# EAGLE schematic RC522_schematic (EAGLE 7.1.0)
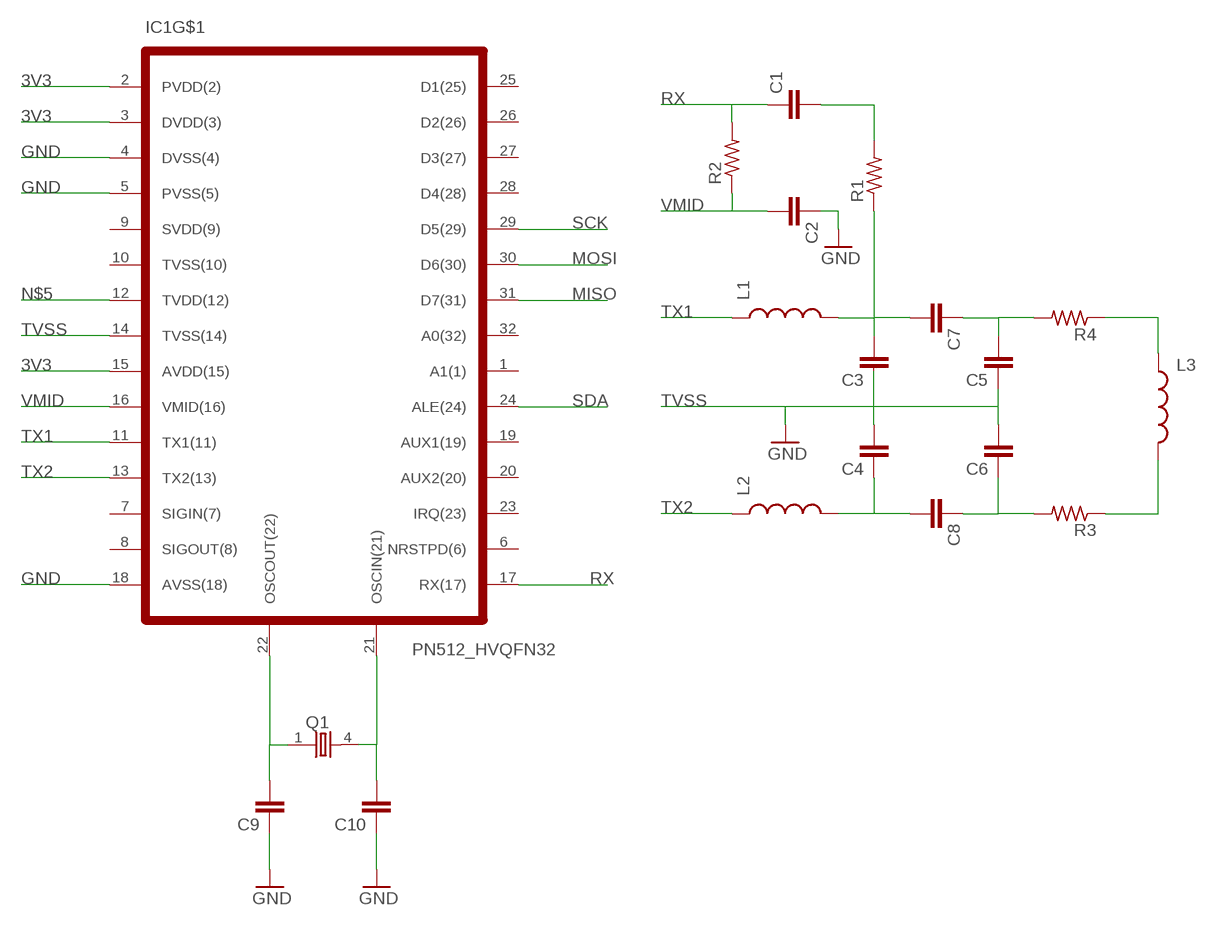
[diagram p0: schematic, sheet 1]

## Parts
C1  CAP0805  [0805]
C2  CAP0805  [0805]
C3  CAP0805  [0805]
C4  CAP0805  [0805]
C5  CAP0805  [0805]
C6  CAP0805  [0805]
C7  CAP0805  [0805]
C8  CAP0805  [0805]
C9  CAP0805  [0805]
C10  CAP0805  [0805]
IC1  PN512_HVQFN32  [HVQFN32]
L1  INDUCTOR0805  [0805]
L2  INDUCTOR0805  [0805]
L3  INDUCTOR0805  [0805]
Q1  86SMX  [86SMX]
R1  R-US_M0805  [M0805]
R2  R-US_M0805  [M0805]
R3  R-US_M0805  [M0805]
R4  R-US_M0805  [M0805]

## Nets
3V3: IC1.2(PVDD(2)) IC1.3(DVDD(3)) IC1.15(AVDD(15))
GND: C2.1 C9.1 C10.1 IC1.4(DVSS(4)) IC1.5(PVSS(5)) IC1.18(AVSS(18))
MISO: IC1.31(D7(31))
MOSI: IC1.30(D6(30))
N$2: C1.2 R1.2
N$5: IC1.12(TVDD(12))
N$6: C3.2 C7.2 L1.2 R1.1
N$7: C9.2 IC1.22(OSCOUT(22)) Q1.1
N$8: C4.1 C8.2 L2.2
N$9: C5.2 C7.1 R4.2
N$10: C6.1 C8.1 R3.2
N$11: C10.2 IC1.21(OSCIN(21)) Q1.4
N$12: L3.1 R4.1
N$13: L3.2 R3.1
RX: C1.1 IC1.17(RX(17)) R2.2
SCK: IC1.29(D5(29))
SDA: IC1.24(ALE(24))
TVSS: C3.1 C4.2 C5.1 C6.2 IC1.14(TVSS(14)) ; supply symbol labelled GND
TX1: IC1.11(TX1(11)) L1.1
TX2: IC1.13(TX2(13)) L2.1
VMID: C2.2 IC1.16(VMID(16)) R2.1
Unconnected: IC1.1(A1(1)) IC1.6(NRSTPD(6)) IC1.7(SIGIN(7)) IC1.8(SIGOUT(8)) IC1.10(TVSS(10)) IC1.19(AUX1(19)) IC1.20(AUX2(20)) IC1.23(IRQ(23)) IC1.25(D1(25)) IC1.26(D2(26)) IC1.27(D3(27)) IC1.28(D4(28)) IC1.32(A0(32)) IC1.HEATSINK

## Power pins joined to a net without a drawn wire
SVDD(9): IC1.9(SVDD(9))

## Library data of the parts
C1-C10 = SparkFun-Capacitors:CAP: Capacitor Standard 0603 ceramic capacitor, and 0.1" leaded capacitor.
IC1 = NXP_RFID_06092011:PN512_HVQFN32: PN512 NFC frontenend in HVQFN32 package, Manufacturer: NXP
L1-L3 = SparkFun-Passives:INDUCTOR: Inductors Basic Inductor/Choke - 0603 and 1206. Footprints are not proven and vary greatly between part numbers. INDUCTOR POWER 3.3UH 4.0A SMD 0.197" L x 0.197" W x 0.177" H (5.00mm x 5.00mm x 4.50mm)
Q1 = crystal:86SMX: CRYSTAL; MF: C-MAC FREQUENCY PRODUCTS LTD; MPN: XTAL003321- 86SMX; OC_FARNELL: 6344914; OC_NEWARK: 01H9866
R1-R4 = resistor:R-US_: RESISTOR, American symbol